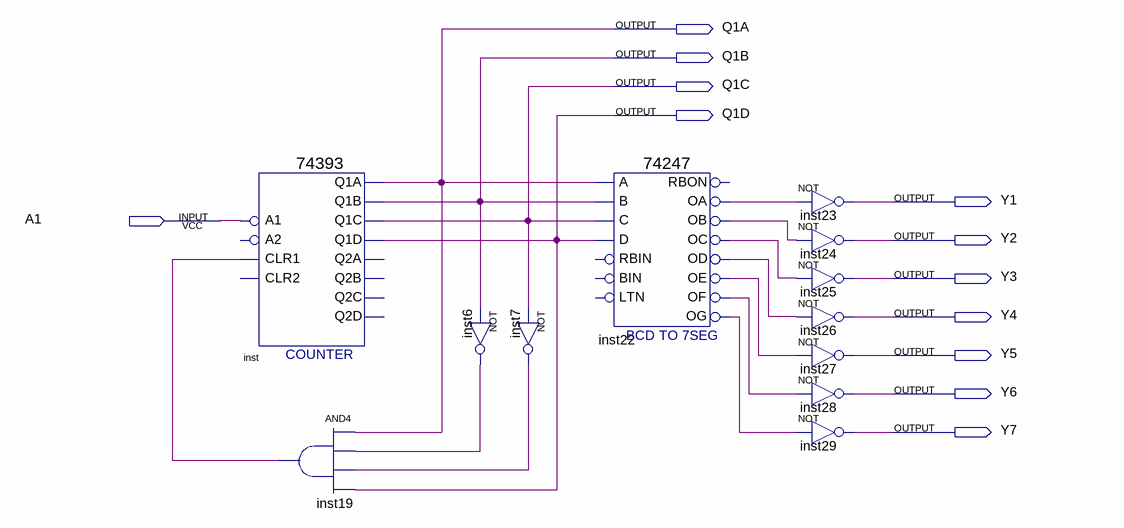
[diagram p0: schematic sheet]
// Quartus schematic lab6_5.bdf as structural Verilog: 12 symbols, 12 pins
module lab6_5 (
  input  A1,
  output Q1A,
  output Q1B,
  output Q1C,
  output Q1D,
  output Y1,
  output Y2,
  output Y3,
  output Y4,
  output Y5,
  output Y6,
  output Y7
);

  wire inst6_out, inst7_out, inst19_out, inst22_oa, inst22_ob, inst22_oc, inst22_od, inst22_oe, inst22_of,
       inst22_og;

  \74393  inst (
    .A1(A1), .CLR1(inst19_out), .Q1C(Q1C), .Q1D(Q1D), .Q1A(Q1A), .Q1B(Q1B));  // open: A2, CLR2, Q2D, Q2C, Q2B, Q2A
  and inst19 (inst19_out, Q1A, inst6_out, inst7_out, Q1D);
  not inst6 (inst6_out, Q1B);
  not inst7 (inst7_out, Q1C);
  \74247  inst22 (
    .A(Q1A), .B(Q1B), .C(Q1C), .D(Q1D), .OF(inst22_of), .OC(inst22_oc), .OD(inst22_od), .OE(inst22_oe),
    .OA(inst22_oa), .OB(inst22_ob), .OG(inst22_og));  // open: LTN, BIN, RBIN, RBON
  not inst23 (Y1, inst22_oa);
  not inst24 (Y2, inst22_ob);
  not inst25 (Y3, inst22_oc);
  not inst26 (Y4, inst22_od);
  not inst27 (Y5, inst22_oe);
  not inst28 (Y6, inst22_of);
  not inst29 (Y7, inst22_og);
endmodule
